# Altium project MiniFoc.PrjPcb
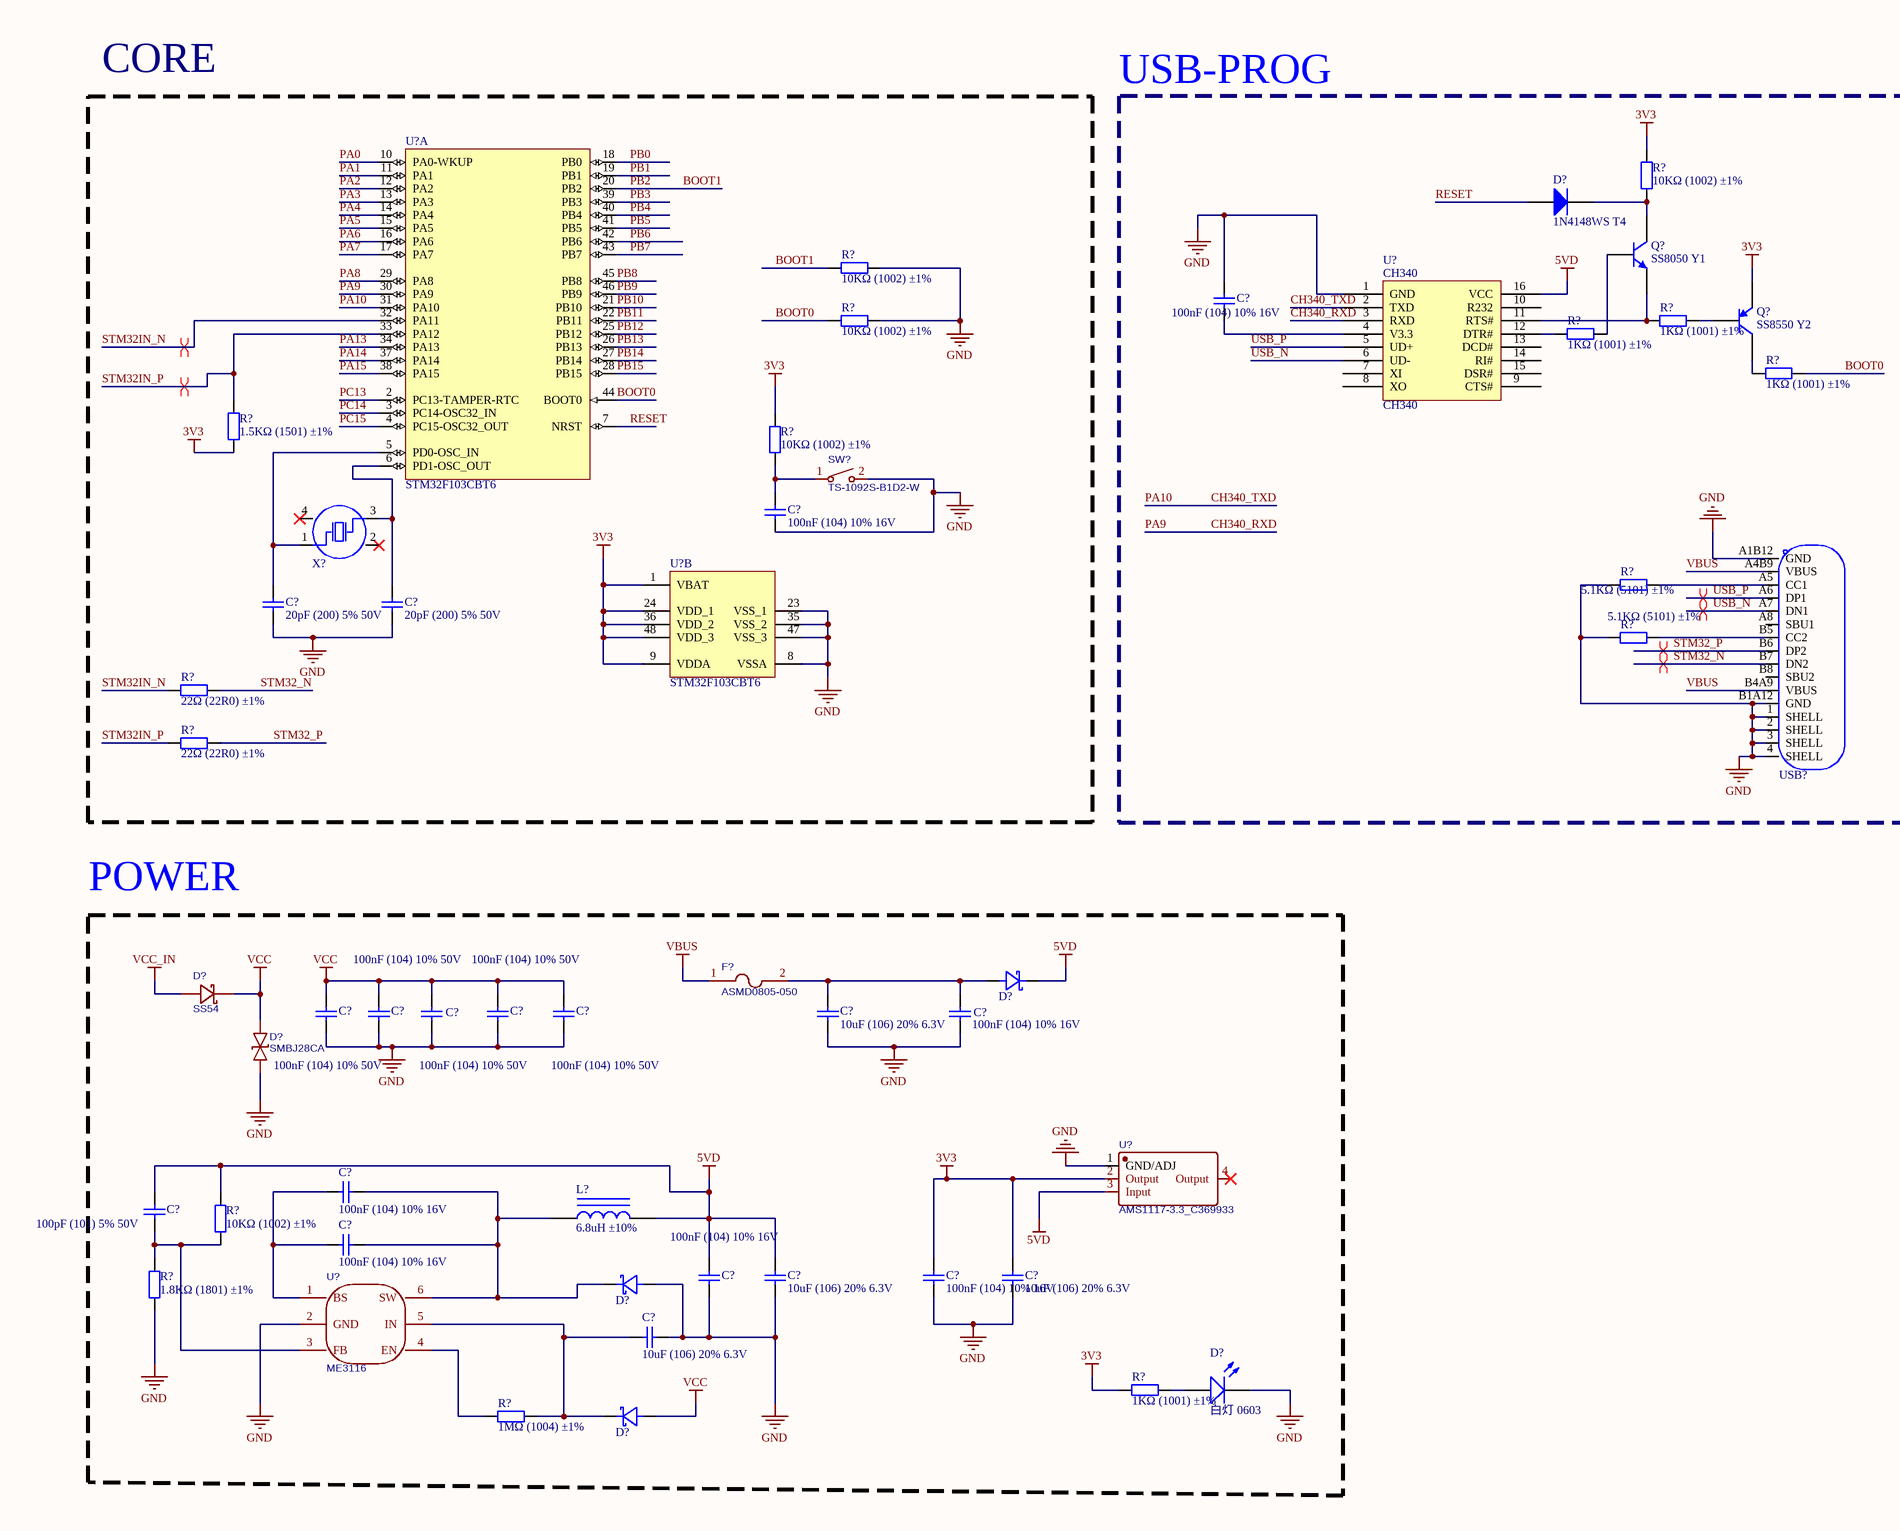
[diagram p0: Main.SchDoc, left]
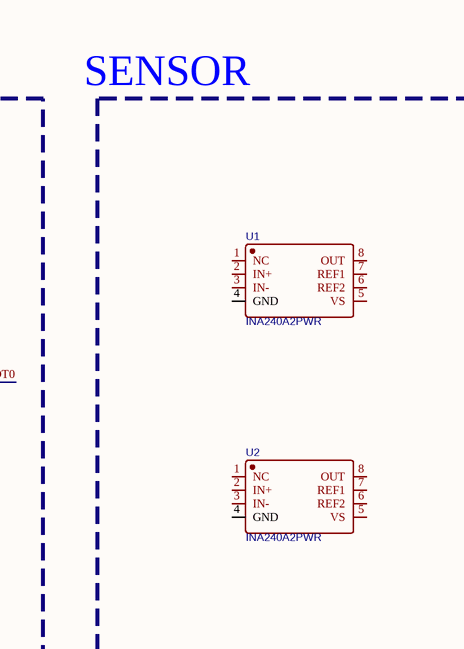
[diagram p1: Main.SchDoc, right]
1 sheet, 56 parts. Net scope: global (net labels, ports and power ports of the same name join across sheets).

## Sheet Main.SchDoc
size A2; SheetNumber: 1; SheetTotal: 1

### Parts
(Parts that share a designator on the sheet are numbered #1, #2 ... from top to bottom, then left to right.)
C?#1  100nF (104) 10% 16V  [0402_C]
C?#2  100nF (104) 10% 16V  [0402_C]
C?#3  20pF (200) 5% 50V  [0402_C]
C?#4  20pF (200) 5% 50V  [0402_C]
C?#5  100nF (104) 10% 50V  [1206_C]
C?#6  100nF (104) 10% 50V  [1206_C]
C?#7  100nF (104) 10% 50V  [1206_C]
C?#8  100nF (104) 10% 50V  [1206_C]
C?#9  100nF (104) 10% 50V  [1206_C]
C?#10  10uF (106) 20% 6.3V  [0402_C]
C?#11  100nF (104) 10% 16V  [0402_C]
C?#12  100nF (104) 10% 16V  [0402_C]
C?#13  100nF (104) 10% 16V  [0402_C]
C?#14  100pF (101) 5% 50V  [0402_C]
C?#15  100nF (104) 10% 16V  [0402_C]
C?#16  10uF (106) 20% 6.3V  [0402_C]
C?#17  100nF (104) 10% 16V  [0402_C]
C?#18  10uF (106) 20% 6.3V  [0402_C]
C?#19  10uF (106) 20% 6.3V  [0402_C]
D?#1  1N4148WS T4  [SOD-323_L1.8-W1.3-LS2.5-RD]
D?#2  1N5819W  [SOD-123]  (value not drawn)
D?#3  SS54  [SMA_L4.4-W2.8-LS5.4-R-RD]
D?#4  SMBJ28CA  [SMB_L4.6-W3.6-LS5.3-BI]
D?#5  1N5819W  [SOD-123]  (value not drawn)
D?#6  白灯 0603  [0603_LED_S1]
D?#7  1N5819W  [SOD-123]  (value not drawn)
F?  ASMD0805-050  [ASMD0805]
L?  6.8uH ±10%  [1206_L]
Q?#1  SS8050 Y1  [SOT-23(SOT-23-3)]
Q?#2  SS8550 Y2  [SOT-23(SOT-23-3)]
R?#1  10KΩ (1002) ±1%  [0402_R]
R?#2  10KΩ (1002) ±1%  [0402_R]
R?#3  10KΩ (1002) ±1%  [0402_R]
R?#4  1KΩ (1001) ±1%  [0402_R]
R?#5  1KΩ (1001) ±1%  [0402_R]
R?#6  1KΩ (1001) ±1%  [0402_R]
R?#7  1.5KΩ (1501) ±1%  [0402_R]
R?#8  10KΩ (1002) ±1%  [0402_R]
R?#9  5.1KΩ (5101) ±1%  [0402_R]
R?#10  5.1KΩ (5101) ±1%  [0402_R]
R?#11  22Ω (22R0) ±1%  [0402_R]
R?#12  22Ω (22R0) ±1%  [0402_R]
R?#13  10KΩ (1002) ±1%  [0402_R]
R?#14  1.8KΩ (1801) ±1%  [0402_R]
R?#15  1KΩ (1001) ±1%  [0402_R]
R?#16  1MΩ (1004) ±1%  [0402_R]
SW?  TS-1092S-B1D2-W  [SW-SMD_L6.1-W3.6-LS7.9]
U1  INA240A2PWR  [TSSOP-8_L4.4-W3.0-P0.65-LS6.4-BL]
U2  INA240A2PWR  [TSSOP-8_L4.4-W3.0-P0.65-LS6.4-BL]
U?#1  STM32F103CBT6  [STM-LQFP48_N]  (part A of 2)
U?#2  CH340  [SOP-16_L10.0]
U?#3  STM32F103CBT6  [STM-LQFP48_N]  (part B of 2)
U?#4  AMS1117-3.3_C369933  [SOT-223-AMS1117]
U?#5  ME3116  [SOT-23-6_L2.9-W1.6-P0.95-LS2.8-BR]
USB?  TYPE-C16PIN  [TYPE-C-SMD]  (value not drawn)
X?  8MHZ  [OSC-SMD_4P-L5.0-W3.2-BL]  (value not drawn)

### Blocks framed on the sheet
CORE: C?#2-C?#4 R?#2 R?#3 R?#7 R?#8 R?#11 R?#12 SW? U?#1 U?#3 X?
POWER: C?#5-C?#19 D?#2-D?#7 F? L? R?#13-R?#16 U?#4 U?#5

### Nets
3V3: C?#17.2 C?#18.2 Q?#2.2(E) R?#1.2 R?#7.1 R?#8.2 R?#15.1 U?#3.1(VBAT) U?#3.9(VDDA) U?#3.24(VDD_1) U?#3.36(VDD_2) U?#3.48(VDD_3) U?#4.2(Output)
5VD: C?#14.2 C?#15.2 C?#16.2 D?#2.1(C) L?.2 R?#13.2 U?#2.16(VCC) U?#4.3(Input)
GND: C?#1.2 C?#2.1 C?#3.1 C?#4.1 C?#5.1 C?#6.1 C?#7.1 C?#8.1 C?#9.1 C?#10.1 C?#11.1 C?#15.1 C?#16.1 C?#17.1 C?#18.1 C?#19.2 D?#4.1 D?#5.2(A) D?#6.K R?#2.2 R?#3.2 R?#9.1 R?#10.1 R?#14.1 SW?.2 U?#2.1(GND) U?#3.8(VSSA) U?#3.23(VSS_1) U?#3.35(VSS_2) U?#3.47(VSS_3) U?#4.1(GND/ADJ) U?#5.2(GND) USB?.1(SHELL) USB?.2(SHELL) USB?.3(SHELL) USB?.4(SHELL) USB?.A1B12(GND) USB?.B1A12(GND)
VBUS: F?.1 USB?.A4B9(VBUS) USB?.B4A9(VBUS)
VCC: C?#5.2 C?#6.2 C?#7.2 C?#8.2 C?#9.2 D?#3.2(K) D?#4.2 D?#7.2(A)
VCC_IN: D?#3.1(A)
BOOT0: R?#3.1 R?#6.1 U?#1.44(BOOT0)
BOOT1: R?#2.1 U?#1.20(PB2)  [also labelled PB2]
CH340_RXD: U?#1.30(PA9) U?#2.3(RXD)  [also labelled PA9]
CH340_TXD: U?#1.31(PA10) U?#2.2(TXD)  [also labelled PA10]
PA0: U?#1.10(PA0-WKUP)
PA1: U?#1.11(PA1)
PA2: U?#1.12(PA2)
PA3: U?#1.13(PA3)
PA4: U?#1.14(PA4)
PA5: U?#1.15(PA5)
PA6: U?#1.16(PA6)
PA7: U?#1.17(PA7)
PA8: U?#1.29(PA8)
PA13: U?#1.34(PA13)
PA14: U?#1.37(PA14)
PA15: U?#1.38(PA15)
PB0: U?#1.18(PB0)
PB1: U?#1.19(PB1)
PB3: U?#1.39(PB3)
PB4: U?#1.40(PB4)
PB5: U?#1.41(PB5)
PB6: U?#1.42(PB6)
PB7: U?#1.43(PB7)
PB8: U?#1.45(PB8)
PB9: U?#1.46(PB9)
PB10: U?#1.21(PB10)
PB11: U?#1.22(PB11)
PB12: U?#1.25(PB12)
PB13: U?#1.26(PB13)
PB14: U?#1.27(PB14)
PB15: U?#1.28(PB15)
PC13: U?#1.2(PC13-TAMPER-RTC)
PC14: U?#1.3(PC14-OSC32_IN)
PC15: U?#1.4(PC15-OSC32_OUT)
RESET: D?#1.1(A) U?#1.7(NRST)
STM32_N: R?#11.2 USB?.B7(DN2)
STM32_P: R?#12.2 USB?.B6(DP2)
STM32IN_N: R?#11.1 U?#1.32(PA11)
STM32IN_P: R?#7.2 R?#12.1 U?#1.33(PA12)
USB_N: U?#2.6(UD-) USB?.A7(DN1)
USB_P: U?#2.5(UD+) USB?.A6(DP1)
NetC?#1_1: C?#1.1 U?#2.4(V3.3)
NetC?#2_2: C?#2.2 R?#8.1 SW?.1
NetC?#3_2: C?#3.2 U?#1.5(PD0-OSC_IN) X?.1(OSC1)
NetC?#4_2: C?#4.2 U?#1.6(PD1-OSC_OUT) X?.3(OSC2)
NetC?#10_2: C?#10.2 C?#11.2 D?#2.2(A) F?.2
NetC?#12_1: C?#12.1 C?#13.1 U?#5.1(BS)
NetC?#12_2: C?#12.2 C?#13.2 D?#5.1(C) L?.1 U?#5.6(SW)
NetC?#14_1: C?#14.1 R?#13.1 R?#14.2 U?#5.3(FB)
NetC?#19_1: C?#19.1 D?#7.1(C) R?#16.2 U?#5.5(IN)
NetD?#1_2: D?#1.2(K) Q?#1.3(C) R?#1.1
NetD?#6_A: D?#6.A R?#15.2
NetQ?#1_1: Q?#1.1(B) R?#5.2
NetQ?#1_2: Q?#1.2(E) R?#4.1 U?#2.11(RTS#)
NetQ?#2_1: Q?#2.1(B) R?#4.2
NetQ?#2_3: Q?#2.3(C) R?#6.2
NetR?#5_1: R?#5.1 U?#2.12(DTR#)
NetR?#9_2: R?#9.2 USB?.A5(CC1)
NetR?#10_2: R?#10.2 USB?.B5(CC2)
NetR?#16_1: R?#16.1 U?#5.4(EN)

Not connected (* = marked no-connect by the designer): U1 1(NC) 2(IN+) 3(IN-) 4(GND) 5(VS) 6(REF2) 7(REF1) 8(OUT); U2 1(NC) 2(IN+) 3(IN-) 4(GND) 5(VS) 6(REF2) 7(REF1) 8(OUT); U?#2 7(XI) 8(XO) 9(CTS#) 10(R232) 13(DCD#) 14(RI#) 15(DSR#); U?#4 4(Output)*; USB? A8(SBU1) B8(SBU2); X? 2(GND)* 4(GND)*

### Layout directives
differential pair: STM32_N, STM32_P, STM32IN_N, STM32IN_P, USB_N, USB_P

### Notes on the sheet
- USB-PROG
- SENSOR

### Library data of the parts
C?#1 C?#2 C?#11-C?#13 C?#15 C?#17 = 0402 100nF (104) 10% 16V: 贴片电容; ComponentLink1Description: 供应商链接; ComponentLink1URL: http://www.szlcsc.com/product/details_1877.html; Package: 0402; Supplier: LC; SuppliersPartNumber: C1525
C?#3 C?#4 = 0402 20pF (200) 5% 50V: 贴片电容; ComponentLink1Description: 供应商链接; ComponentLink1URL: http://www.szlcsc.com/product/details_1906.html; Package: 0402; Supplier: LC; SuppliersPartNumber: C1554
C?#5-C?#9 = 1206 100nF (104) 10% 50V: 贴片电容; ComponentLink1Description: 供应商链接; ComponentLink1URL: http://www.szlcsc.com/product/details_25237.html; Package: 1206; Supplier: LC; SuppliersPartNumber: C24497
C?#10 C?#16 C?#18 C?#19 = 0402 10uF (106) 20% 6.3V: 贴片电容; ComponentLink1Description: 供应商链接; ComponentLink1URL: http://www.szlcsc.com/product/details_16204.html; Package: 0402; Supplier: LC; SuppliersPartNumber: C15525
C?#14 = 0402 100pF (101) 5% 50V: 贴片电容; ComponentLink1Description: 供应商链接; ComponentLink1URL: http://www.szlcsc.com/product/details_1898.html; Package: 0402; Supplier: LC; SuppliersPartNumber: C1546
D?#1 = SOD-323 1N4148WS T4: 二极管; ComponentLink1Description: 供应商链接; ComponentLink1URL: http://www.szlcsc.com/product/details_2485.html; Package: SOD-323; Supplier: LC; SuppliersPartNumber: C2128
D?#2 D?#5 D?#7 = 1N5819W: 二极管; Manufacturer: TWGMC(台湾迪嘉); Symbol: 1N5819W_C727115; Add into BOM: yes; Diode Configuration: 独立式; Reverse Voltage (Vr): 40V; Average Rectified Current (Io): 1A; Forward Voltage (Vf@If): 900mV@3A; Reverse Leakage Current (Ir): 1mA@40V; Device: 1N5819W_C727115; LCSC Part Name: 40V 1A 900mV@3A; Supplier Part: C727115; Manufacturer Part: 1N5819W; Supplier Footprint: SOD-123; JLCPCB Part Class: Extended Part; Datasheet: https://atta.szlcsc.com/upload/public/pdf/source/20200828/C727113_260B72EC53C389C21DF1E8AB243F1BFC.pdf; Supplier: LCSC; Convert to PCB: yes
D?#3 = SS54: BOM_Manufacturer: Slkor(SLKORMICRO Elec.); Contributor: LCSC; BOM_Supplier: LCSC; BOM_Supplier Part: C513478; BOM_Manufacturer Part: SS54; BOM_JLCPCB Part Class: Extended Part; spicePre: D; spiceSymbolName: SS54_C513478
D?#4 = SMBJ28CA: BOM_Manufacturer: FTR; Contributor: LCSC; BOM_Supplier: LCSC; BOM_Supplier Part: C693498; BOM_Manufacturer Part: SMBJ28CA; BOM_JLCPCB Part Class: Extended Part; spicePre: D; spiceSymbolName: SMBJ28CA_C693498
D?#6 = 0603 白灯: 发光二极管; ComponentLink1Description: 供应商链接; ComponentLink1URL: http://www.szlcsc.com/product/details_2663.html; Package: 0603; Supplier: LC; SuppliersPartNumber: C2290
F? = ASMD0805-050: BOM_Manufacturer: JDTFUSE; Contributor: LCSC; BOM_Supplier: LCSC; BOM_Manufacturer Part: ASMD0805-050; BOM_Supplier Part: C135329; BOM_JLCPCB Part Class: Extended Part; spicePre: F; spiceSymbolName: ASMD0805-050
L? = 1206 10uH 10%: 贴片电感; ComponentLink1Description: 供应商链接; ComponentLink1URL: http://www.szlcsc.com/product/details_1403.html; Package: 1206; Supplier: LC; SuppliersPartNumber: C1051
Q?#1 = SOT-23 SS8050 Y1: 三极管; ComponentLink1Description: 供应商链接; ComponentLink1URL: http://www.szlcsc.com/product/details_2507.html; Package: SOT-23; Supplier: LC; SuppliersPartNumber: C2150
Q?#2 = SOT-23 SS8550 Y2: 三极管; ComponentLink1Description: 供应商链接; ComponentLink1URL: http://www.szlcsc.com/product/details_9037.html; Package: SOT-23; Supplier: LC; SuppliersPartNumber: C8542
R?#1-R?#3 R?#8 R?#13 = 0402 10KΩ (1002) 1%: 贴片电阻; ComponentLink1Description: 供应商链接; ComponentLink1URL: http://www.szlcsc.com/product/details_26487.html; Package: 0402; Supplier: LC; SuppliersPartNumber: C25744
R?#4-R?#6 R?#15 = 0402 1KΩ (1001) 1%: 贴片电阻; ComponentLink1Description: 供应商链接; ComponentLink1URL: http://www.szlcsc.com/product/details_12256.html; Package: 0402; Supplier: LC; SuppliersPartNumber: C11702
R?#7 R?#14 = 0402 1.5KΩ (1501) 1%: 贴片电阻; ComponentLink1Description: 供应商链接; ComponentLink1URL: http://www.szlcsc.com/product/details_26610.html; Package: 0402; Supplier: LC; SuppliersPartNumber: C25867
R?#9 R?#10 = 0402 5.1KΩ (5101) 1%: 贴片电阻; ComponentLink1Description: 供应商链接; ComponentLink1URL: http://www.szlcsc.com/product/details_26648.html; Package: 0402; Supplier: LC; SuppliersPartNumber: C25905
R?#11 R?#12 = 0402 22Ω (22R0) 1%: 贴片电阻; ComponentLink1Description: 供应商链接; ComponentLink1URL: http://www.szlcsc.com/product/details_25835.html; Package: 0402; Supplier: LC; SuppliersPartNumber: C25092
R?#16 = 0402 1MΩ (1004) 1%: 贴片电阻; ComponentLink1Description: 供应商链接; ComponentLink1URL: http://www.szlcsc.com/product/details_26826.html; Package: 0402; Supplier: LC; SuppliersPartNumber: C26083
SW? = TS-1092S-B1D2-W: 触控开关; BOM_Manufacturer: Yuandi(台湾元迪); Contributor: LCSC; BOM_Supplier: LCSC; BOM_Supplier Part: C782859; BOM_Manufacturer Part: TS-1092S-B1D2-W; BOM_JLCPCB Part Class: Extended Part; spicePre: S; spiceSymbolName: TS-1092S-B1D2-W
U1 U2 = INA240A2PWR: BOM_Manufacturer: TI; subpart_no: 1; Contributor: LCSC; BOM_Supplier: LCSC; BOM_Manufacturer Part: INA240A2PWR; BOM_Supplier Part: C129949; BOM_JLCPCB Part Class: Extended Part; spicePre: U; spiceSymbolName: INA240A2PWR
U?#1 U?#3 = STM32F103CBT6: ARM Cortex-M3 32-bit MCU, 128 KB Flash, 20 KB Internal RAM, 37 I/Os, 48-pin LQFP, -40 to 85 degC, Tray; A/D Converter: 2x12-bit (10 Channel); FLASH Size (Prog) (kB): 128; I/Os (High Current): 37; Internal RAM Size (kB): 20; Operating Frequency(F) (Processor speed) (MHz): 72; Supply Voltage(Vcc) min (V): 2; DatasheetVersion: Rev. 16; PackageVersion: Rev. 6, 06/2013; PackageReference: LQFP48; PackageDescription: 48-Pin Low Profile Quad Flat Package, 7 x 7 mm Body, 0.5 mm Pitch; Supplier 1: Digi-Key; Supplier Part Number 1: 497-6288-ND; Supplier 2: Farnell; Supplier Part Number 2: 1606327; Supplier 3: Newark; Supplier Part Number 3: 11N8296; Supplier 4: Newark; Supplier Part Number 4: 57P1214; Supplier 5: Mouser; Supplier Part Number 5: 511-STM32F103CBT6; Core: ARM Cortex-M3; Packing: Tray; Mounting Technology: Surface Mount; PartNumber: STM32F103CBT6; ComponentLink1Description: Manufacturer URL; ComponentLink1URL: http://www.st.com/web/en/home.html; ComponentLink2Description: Datasheet; ComponentLink2URL: http://www.st.com/st-web-ui/static/active/en/resource/technical/document/datasheet/CD00161566.pdf; ComponentLink3Description: Package Specification; ComponentLink3URL: http://www.st.com/st-web-ui/static/active/en/resource/technical/document/datasheet/DM00058181.pdf
U?#2 = CH340: USB to serial; ComponentLink1Description: 供应商链接; ComponentLink1URL: http://www.szlcsc.com/product/details_14927.html; Package: SOIC-16_150mil; Supplier: LC; SuppliersPartNumber: C14267
U?#4 = AMS1117-3.3: BOM_Manufacturer: KEXIN; Contributor: LCSC; BOM_Paste Type: expand; BOM_Supplier: LCSC; BOM_Supplier Part: C369933; BOM_Manufacturer Part: AMS1117-3.3; spicePre: U; spiceSymbolName: AMS1117-3.3_C369933
U?#5 = ME3116: BOM_Manufacturer: MICRONE; BOM_Supplier: LCSC; BOM_Manufacturer Part: ME3116; BOM_Supplier Part: C97643; BOM_JLCPCB Part Class: Extended Part; spicePre: U; spiceSymbolName: ME3116
USB? = TYPE-C16PIN: Manufacturer: SHOU HAN(首韩); Add into BOM: yes; Connector Type: Type-C; Gender: 母座; Number of Contacts: 16; Number of Ports: 1; Current Rating - Power (Max): 3A; Symbol: TYPE-C16PIN; Device: TYPE-C16PIN; LCSC Part Name: Type-C 母座 卧贴 快充闪充 停产; Supplier Part: C393939; Manufacturer Part: TYPE-C16PIN; Supplier Footprint: SMD; JLCPCB Part Class: Extended Part; Datasheet: https://atta.szlcsc.com/upload/public/pdf/source/20190521/C393939_7B9043D4CF1026AF443AB60D91FBCD5C.pdf; Supplier: LCSC; Convert to PCB: yes; Standard: -; Mounting Style: 卧贴; Operating Temperature Range: -40~+85
X? = 8MHZ: 8M 30PPM 20pf; Manufacturer: SIWARD(台湾希华); Symbol: XTL541200-C282-030; Add into BOM: yes; Device: XTL541200-C282-030; LCSC Part Name: 8MHz 20pF 20PPM; Supplier Part: C211359; Manufacturer Part: XTL541200-C282-030; Supplier Footprint: SMD5032-4P; JLCPCB Part Class: Extended Part; Datasheet: https://atta.szlcsc.com/upload/public/pdf/source/20180502/C211359_C3A699E12D7D0972204A7F7616890513.pdf; Supplier: LCSC; Convert to PCB: yes; Crystal Type: -; Frequency Tolerance: -; Frequency Stability: -; Load Capacitance: -; Operating Temperature: -